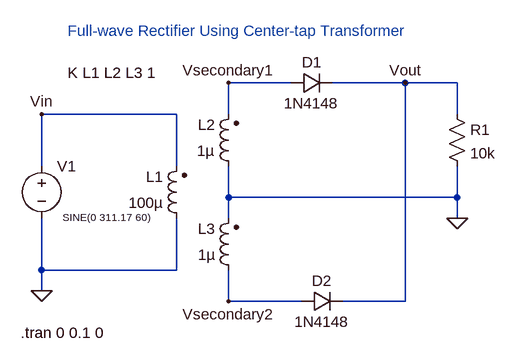
[diagram p0: schematic 2EEB_VELASCO_EXPT3_CKT5.asc]
2EEB_VELASCO_EXPT3_CKT5.asc, the LTspice schematic file:
Version 4
SHEET 1 880 680
WIRE 448 -48 352 -48
WIRE 624 -48 512 -48
WIRE 704 -48 624 -48
WIRE 272 0 64 0
WIRE 352 0 352 -48
WIRE 704 0 704 -48
WIRE 64 80 64 0
WIRE 272 80 272 0
WIRE 352 128 352 80
WIRE 704 128 704 80
WIRE 704 128 352 128
WIRE 352 160 352 128
WIRE 704 160 704 128
WIRE 64 240 64 160
WIRE 272 240 272 160
WIRE 272 240 64 240
WIRE 64 272 64 240
WIRE 352 288 352 240
WIRE 464 288 352 288
WIRE 624 288 624 -48
WIRE 624 288 528 288
FLAG 704 160 0
FLAG 64 272 0
FLAG 64 0 Vin
FLAG 352 -48 Vsecondary1
FLAG 624 -48 Vout
FLAG 352 288 Vsecondary2
SYMBOL voltage 64 64 R0
WINDOW 3 99 105 Bottom 1
WINDOW 123 0 0 Left 0
WINDOW 39 99 133 Bottom 1
SYMATTR Value SINE(0 311.17 60)
SYMATTR InstName V1
SYMBOL diode 448 -32 R270
WINDOW 0 32 32 VTop 2
WINDOW 3 0 32 VBottom 2
SYMATTR InstName D1
SYMATTR Value 1N4148
SYMBOL diode 464 304 R270
WINDOW 0 32 32 VTop 2
WINDOW 3 0 32 VBottom 2
SYMATTR InstName D2
SYMATTR Value 1N4148
SYMBOL ind2 288 176 R180
WINDOW 0 36 80 Left 2
WINDOW 3 36 40 Left 2
SYMATTR InstName L1
SYMATTR Value 100µ
SYMATTR SpiceLine Rser=0.001
SYMBOL ind2 368 96 R180
WINDOW 0 36 80 Left 2
WINDOW 3 51 40 Center 2
SYMATTR InstName L2
SYMATTR Value 1µ
SYMBOL ind2 368 256 R180
WINDOW 0 36 80 Left 2
WINDOW 3 36 40 Left 2
SYMATTR InstName L3
SYMATTR Value 1µ
SYMBOL res 688 -16 R0
SYMATTR InstName R1
SYMATTR Value 10k
TEXT 32 336 Left 2 !.tran 0 0.1 0
TEXT 104 -64 Left 2 !K L1 L2 L3 1
TEXT 104 -128 Left 2 ;Full-wave Rectifier Using Center-tap Transformer

The netlist it stands for:
* 2EEB_VELASCO_EXPT3_CKT5.asc
V1 Vin 0 SINE(0 311.17 60)
D1 Vsecondary1 Vout 1N4148
D2 Vsecondary2 Vout 1N4148
L1 0 Vin 100µ Rser=0.001
L2 0 Vsecondary1 1µ
L3 Vsecondary2 0 1µ
R1 Vout 0 10k
.model D D
.lib standard.dio
.tran 0 0.1 0
K L1 L2 L3 1
* Full-wave Rectifier Using Center-tap Transformer
.backanno
.end